# Altium schematic sheet SFP+_Connectors.SchDoc
size A3; SheetNumber: 5; SheetTotal: 22
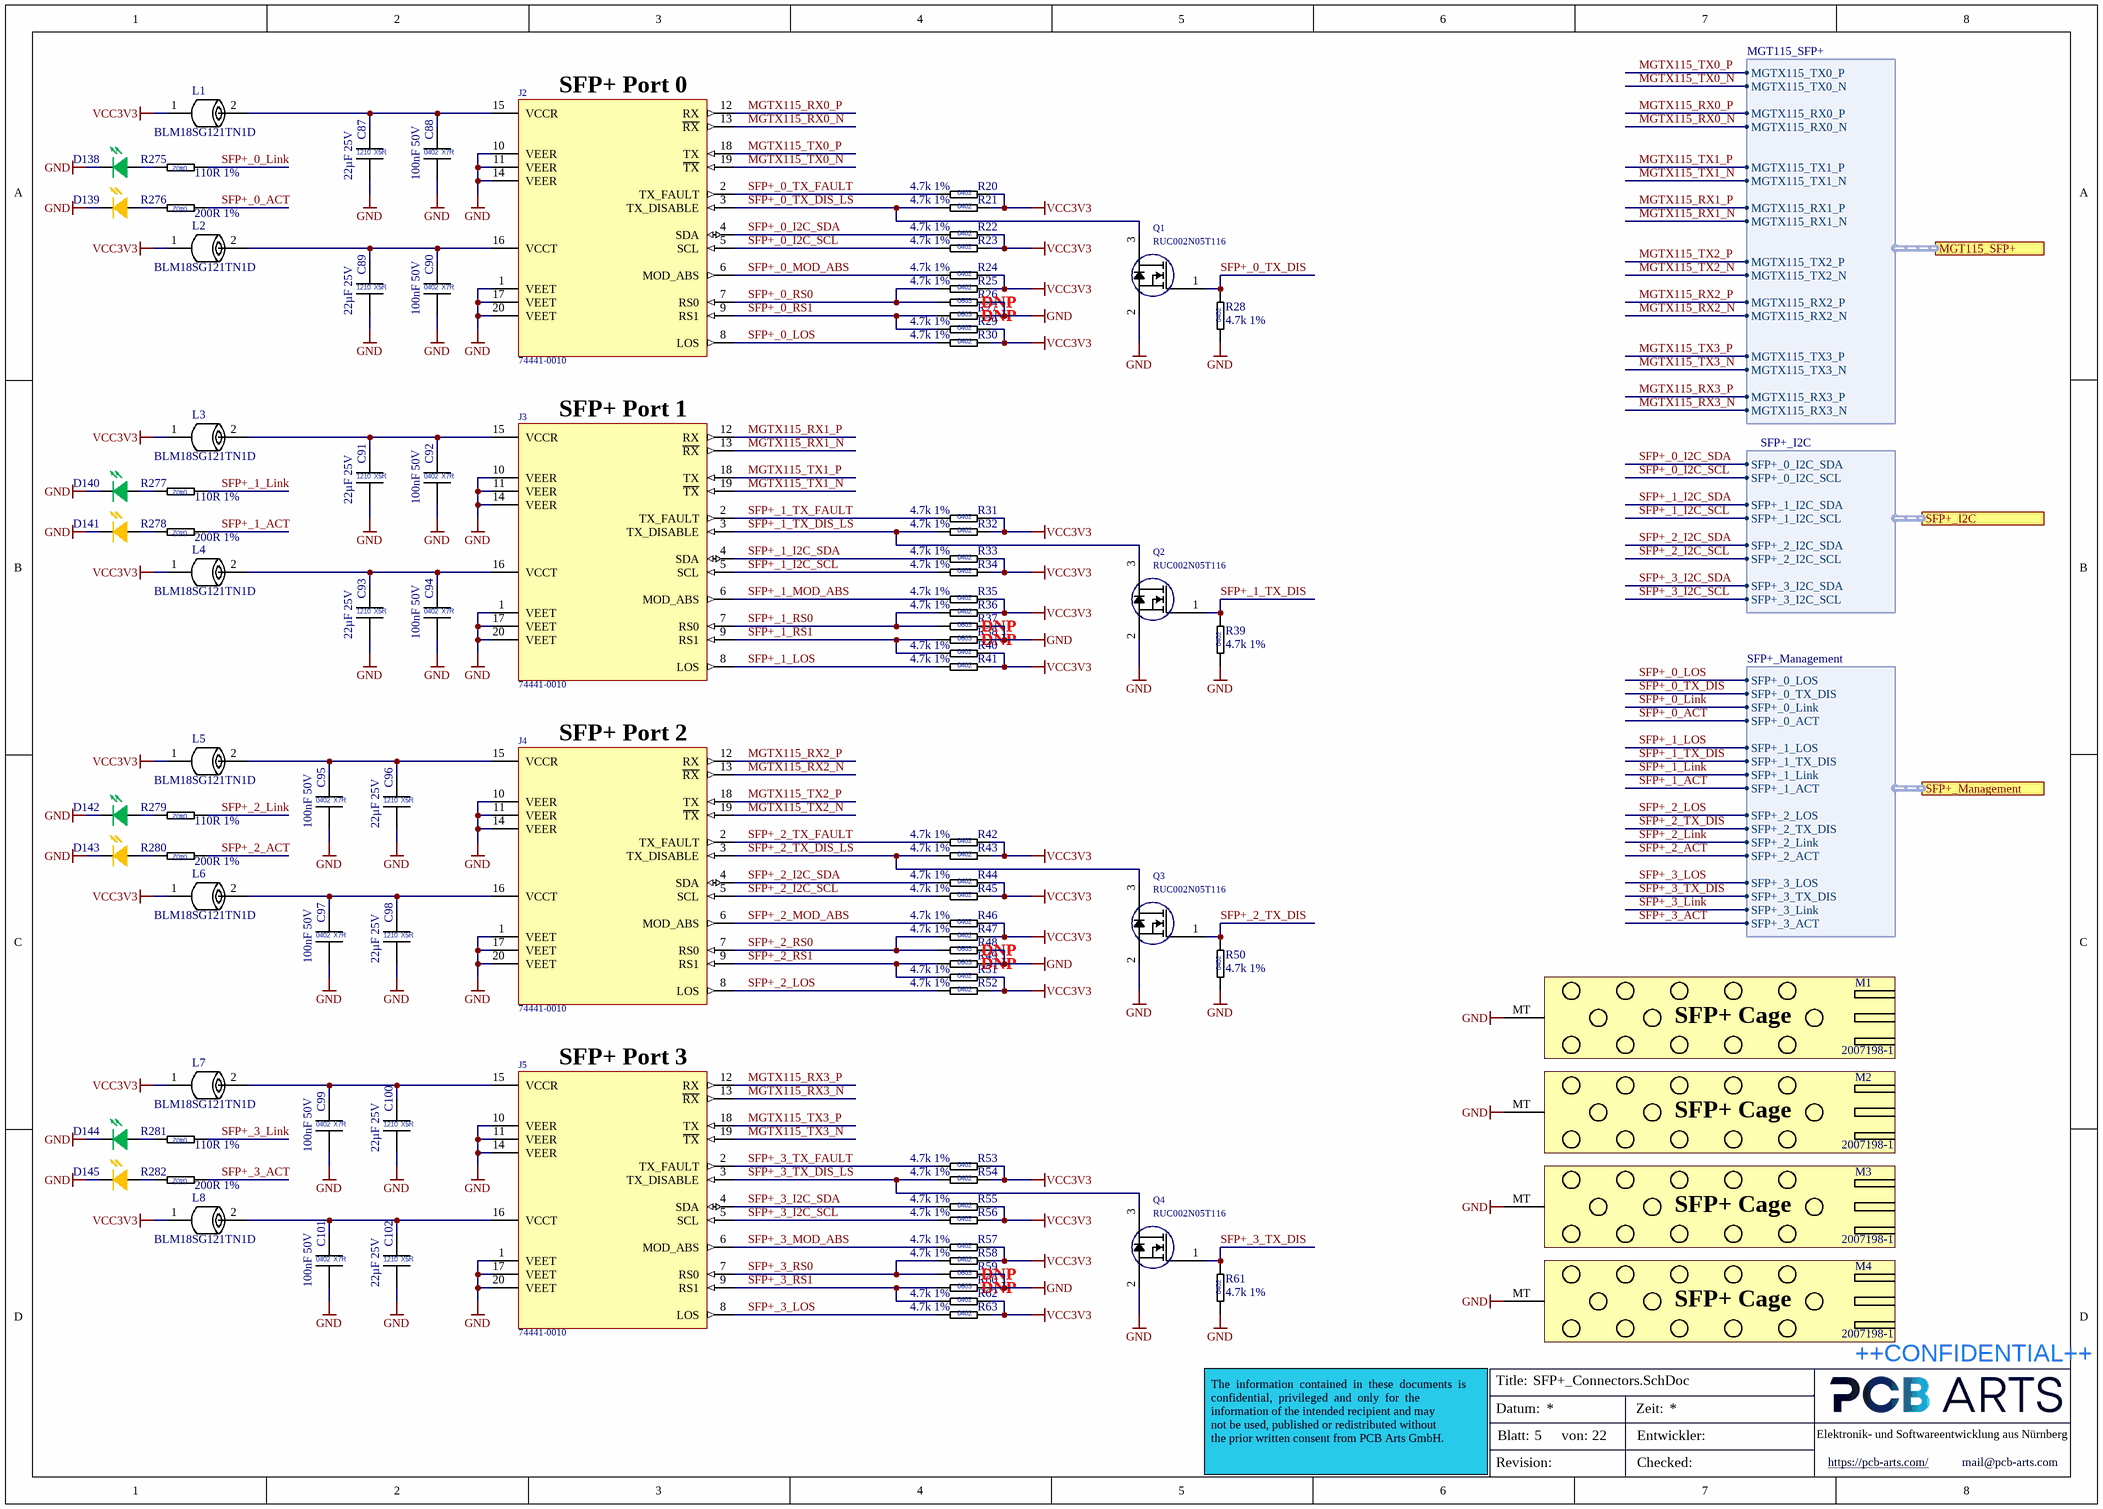
[diagram p0: SFP+_Connectors.SchDoc]

## Parts
C87  22µF 25V  [CAP_1210]
C88  100nF 50V  [CAP_0402_L]
C89  22µF 25V  [CAP_1210]
C90  100nF 50V  [CAP_0402_L]
C91  22µF 25V  [CAP_1210]
C92  100nF 50V  [CAP_0402_L]
C93  22µF 25V  [CAP_1210]
C94  100nF 50V  [CAP_0402_L]
C95  100nF 50V  [CAP_0402_L]
C96  22µF 25V  [CAP_1210]
C97  100nF 50V  [CAP_0402_L]
C98  22µF 25V  [CAP_1210]
C99  100nF 50V  [CAP_0402_L]
C100  22µF 25V  [CAP_1210]
C101  100nF 50V  [CAP_0402_L]
C102  22µF 25V  [CAP_1210]
D138  LTST-S270KGKT  [LED-0603 Sideview]  (value not drawn)
D139  LTST-S270KFKT  [LED-0603 Sideview]  (value not drawn)
D140  LTST-S270KGKT  [LED-0603 Sideview]  (value not drawn)
D141  LTST-S270KFKT  [LED-0603 Sideview]  (value not drawn)
D142  LTST-S270KGKT  [LED-0603 Sideview]  (value not drawn)
D143  LTST-S270KFKT  [LED-0603 Sideview]  (value not drawn)
D144  LTST-S270KGKT  [LED-0603 Sideview]  (value not drawn)
D145  LTST-S270KFKT  [LED-0603 Sideview]  (value not drawn)
J2  74441-0010  [74441-0010]
J3  74441-0010  [74441-0010]
J4  74441-0010  [74441-0010]
J5  74441-0010  [74441-0010]
L1  BLM18SG121TN1D  [L_0603]
L2  BLM18SG121TN1D  [L_0603]
L3  BLM18SG121TN1D  [L_0603]
L4  BLM18SG121TN1D  [L_0603]
L5  BLM18SG121TN1D  [L_0603]
L6  BLM18SG121TN1D  [L_0603]
L7  BLM18SG121TN1D  [L_0603]
L8  BLM18SG121TN1D  [L_0603]
M1  2007198-1  [2007198-1]
M2  2007198-1  [2007198-1]
M3  2007198-1  [2007198-1]
M4  2007198-1  [2007198-1]
Q1  RUC002N05T116  [SOT95P251X112-3N]
Q2  RUC002N05T116  [SOT95P251X112-3N]
Q3  RUC002N05T116  [SOT95P251X112-3N]
Q4  RUC002N05T116  [SOT95P251X112-3N]
R20  4.7k 1%  [RES_0402_L]
R21  4.7k 1%  [RES_0402_L]
R22  4.7k 1%  [RES_0402_L]
R23  4.7k 1%  [RES_0402_L]
R24  4.7k 1%  [RES_0402_L]
R25  4.7k 1%  [RES_0402_L]
R26  0R Jumper  [RES_0603_L]  (value not drawn)  (no BOM)
R27  0R Jumper  [RES_0603_L]  (value not drawn)  (no BOM)
R28  4.7k 1%  [RES_0402_L]
R29  4.7k 1%  [RES_0402_L]
R30  4.7k 1%  [RES_0402_L]
R31  4.7k 1%  [RES_0402_L]
R32  4.7k 1%  [RES_0402_L]
R33  4.7k 1%  [RES_0402_L]
R34  4.7k 1%  [RES_0402_L]
R35  4.7k 1%  [RES_0402_L]
R36  4.7k 1%  [RES_0402_L]
R37  0R Jumper  [RES_0603_L]  (value not drawn)  (no BOM)
R38  0R Jumper  [RES_0603_L]  (value not drawn)  (no BOM)
R39  4.7k 1%  [RES_0402_L]
R40  4.7k 1%  [RES_0402_L]
R41  4.7k 1%  [RES_0402_L]
R42  4.7k 1%  [RES_0402_L]
R43  4.7k 1%  [RES_0402_L]
R44  4.7k 1%  [RES_0402_L]
R45  4.7k 1%  [RES_0402_L]
R46  4.7k 1%  [RES_0402_L]
R47  4.7k 1%  [RES_0402_L]
R48  0R Jumper  [RES_0603_L]  (value not drawn)  (no BOM)
R49  0R Jumper  [RES_0603_L]  (value not drawn)  (no BOM)
R50  4.7k 1%  [RES_0402_L]
R51  4.7k 1%  [RES_0402_L]
R52  4.7k 1%  [RES_0402_L]
R53  4.7k 1%  [RES_0402_L]
R54  4.7k 1%  [RES_0402_L]
R55  4.7k 1%  [RES_0402_L]
R56  4.7k 1%  [RES_0402_L]
R57  4.7k 1%  [RES_0402_L]
R58  4.7k 1%  [RES_0402_L]
R59  0R Jumper  [RES_0603_L]  (value not drawn)  (no BOM)
R60  0R Jumper  [RES_0603_L]  (value not drawn)  (no BOM)
R61  4.7k 1%  [RES_0402_L]
R62  4.7k 1%  [RES_0402_L]
R63  4.7k 1%  [RES_0402_L]
R275  110R 1%  [RES_0402_L]
R276  200R 1%  [RES_0402_L]
R277  110R 1%  [RES_0402_L]
R278  200R 1%  [RES_0402_L]
R279  110R 1%  [RES_0402_L]
R280  200R 1%  [RES_0402_L]
R281  110R 1%  [RES_0402_L]
R282  200R 1%  [RES_0402_L]

## Ports
MGT115_SFP+ (harness MGT115_SFP+, see Top-Level-Sheet[6B], MGT Banks 115-116[8A]), SFP+_I2C (harness SFP+_I2C, see Top-Level-Sheet[6B], I2C Multiplexer[7A]), SFP+_Management (harness SFP+_Management, see Top-Level-Sheet[6B], Bank 13_Bank 15_Bank 16[8D])

## Harnesses
MGT115_SFP+: MGTX115_TX0_P, MGTX115_TX0_N, MGTX115_RX0_P, MGTX115_RX0_N, MGTX115_TX1_P, MGTX115_TX1_N, MGTX115_RX1_P, MGTX115_RX1_N, MGTX115_TX2_P, MGTX115_TX2_N, MGTX115_RX2_P, MGTX115_RX2_N, MGTX115_TX3_P, MGTX115_TX3_N, MGTX115_RX3_P, MGTX115_RX3_N
SFP+_I2C: SFP+_3_I2C_SDA, SFP+_3_I2C_SCL, SFP+_0_I2C_SDA, SFP+_0_I2C_SCL, SFP+_1_I2C_SDA, SFP+_1_I2C_SCL, SFP+_2_I2C_SDA, SFP+_2_I2C_SCL
SFP+_Management: SFP+_0_LOS, SFP+_0_TX_DIS, SFP+_0_Link, SFP+_0_ACT, SFP+_1_LOS, SFP+_1_TX_DIS, SFP+_1_Link, SFP+_1_ACT, SFP+_2_LOS, SFP+_2_TX_DIS, SFP+_2_Link, SFP+_2_ACT, SFP+_3_LOS, SFP+_3_TX_DIS, SFP+_3_Link, SFP+_3_ACT

## Nets
GND: C87.2 C88.2 C89.2 C90.2 C91.2 C92.2 C93.2 C94.2 C95.2 C96.2 C97.2 C98.2 C99.2 C100.2 C101.2 C102.2 D138.1 D139.1 D140.1 D141.1 D142.1 D143.1 D144.1 D145.1 J2.1(VEET) J2.10(VEER) J2.11(VEER) J2.14(VEER) J2.17(VEET) J2.20(VEET) J3.1(VEET) J3.10(VEER) J3.11(VEER) J3.14(VEER) J3.17(VEET) J3.20(VEET) J4.1(VEET) J4.10(VEER) J4.11(VEER) J4.14(VEER) J4.17(VEET) J4.20(VEET) J5.1(VEET) J5.10(VEER) J5.11(VEER) J5.14(VEER) J5.17(VEET) J5.20(VEET) M1.MT M2.MT M3.MT M4.MT Q1.2(D) Q2.2(D) Q3.2(D) Q4.2(D) R26.2 R27.2 R28.1 R37.2 R38.2 R39.1 R48.2 R49.2 R50.1 R59.2 R60.2 R61.1
VCC3V3: L1.1 L2.1 L3.1 L4.1 L5.1 L6.1 L7.1 L8.1 R20.2 R21.2 R22.2 R23.2 R24.2 R25.2 R29.2 R30.2 R31.2 R32.2 R33.2 R34.2 R35.2 R36.2 R40.2 R41.2 R42.2 R43.2 R44.2 R45.2 R46.2 R47.2 R51.2 R52.2 R53.2 R54.2 R55.2 R56.2 R57.2 R58.2 R62.2 R63.2
MGTX115_RX0_N: J2.13(~{RX}) ; port MGT115_SFP+.MGTX115_RX0_N
MGTX115_RX0_P: J2.12(RX) ; port MGT115_SFP+.MGTX115_RX0_P
MGTX115_RX1_N: J3.13(~{RX}) ; port MGT115_SFP+.MGTX115_RX1_N
MGTX115_RX1_P: J3.12(RX) ; port MGT115_SFP+.MGTX115_RX1_P
MGTX115_RX2_N: J4.13(~{RX}) ; port MGT115_SFP+.MGTX115_RX2_N
MGTX115_RX2_P: J4.12(RX) ; port MGT115_SFP+.MGTX115_RX2_P
MGTX115_RX3_N: J5.13(~{RX}) ; port MGT115_SFP+.MGTX115_RX3_N
MGTX115_RX3_P: J5.12(RX) ; port MGT115_SFP+.MGTX115_RX3_P
MGTX115_TX0_N: J2.19(~{TX}) ; port MGT115_SFP+.MGTX115_TX0_N
MGTX115_TX0_P: J2.18(TX) ; port MGT115_SFP+.MGTX115_TX0_P
MGTX115_TX1_N: J3.19(~{TX}) ; port MGT115_SFP+.MGTX115_TX1_N
MGTX115_TX1_P: J3.18(TX) ; port MGT115_SFP+.MGTX115_TX1_P
MGTX115_TX2_N: J4.19(~{TX}) ; port MGT115_SFP+.MGTX115_TX2_N
MGTX115_TX2_P: J4.18(TX) ; port MGT115_SFP+.MGTX115_TX2_P
MGTX115_TX3_N: J5.19(~{TX}) ; port MGT115_SFP+.MGTX115_TX3_N
MGTX115_TX3_P: J5.18(TX) ; port MGT115_SFP+.MGTX115_TX3_P
SFP+_0_ACT: R276.1 ; port SFP+_Management.SFP+_0_ACT
SFP+_0_I2C_SCL: J2.5(SCL) R23.1 ; port SFP+_I2C.SFP+_0_I2C_SCL
SFP+_0_I2C_SDA: J2.4(SDA) R22.1 ; port SFP+_I2C.SFP+_0_I2C_SDA
SFP+_0_Link: R275.1 ; port SFP+_Management.SFP+_0_Link
SFP+_0_LOS: J2.8(LOS) R30.1 ; port SFP+_Management.SFP+_0_LOS
SFP+_0_MOD_ABS: J2.6(MOD_ABS) R24.1
SFP+_0_RS0: J2.7(RS0) R25.1 R26.1
SFP+_0_RS1: J2.9(RS1) R27.1 R29.1
SFP+_0_TX_DIS: Q1.1(G) R28.2 ; port SFP+_Management.SFP+_0_TX_DIS
SFP+_0_TX_DIS_LS: J2.3(TX_DISABLE) Q1.3(S) R21.1
SFP+_0_TX_FAULT: J2.2(TX_FAULT) R20.1
SFP+_1_ACT: R278.1 ; port SFP+_Management.SFP+_1_ACT
SFP+_1_I2C_SCL: J3.5(SCL) R34.1 ; port SFP+_I2C.SFP+_1_I2C_SCL
SFP+_1_I2C_SDA: J3.4(SDA) R33.1 ; port SFP+_I2C.SFP+_1_I2C_SDA
SFP+_1_Link: R277.1 ; port SFP+_Management.SFP+_1_Link
SFP+_1_LOS: J3.8(LOS) R41.1 ; port SFP+_Management.SFP+_1_LOS
SFP+_1_MOD_ABS: J3.6(MOD_ABS) R35.1
SFP+_1_RS0: J3.7(RS0) R36.1 R37.1
SFP+_1_RS1: J3.9(RS1) R38.1 R40.1
SFP+_1_TX_DIS: Q2.1(G) R39.2 ; port SFP+_Management.SFP+_1_TX_DIS
SFP+_1_TX_DIS_LS: J3.3(TX_DISABLE) Q2.3(S) R32.1
SFP+_1_TX_FAULT: J3.2(TX_FAULT) R31.1
SFP+_2_ACT: R280.1 ; port SFP+_Management.SFP+_2_ACT
SFP+_2_I2C_SCL: J4.5(SCL) R45.1 ; port SFP+_I2C.SFP+_2_I2C_SCL
SFP+_2_I2C_SDA: J4.4(SDA) R44.1 ; port SFP+_I2C.SFP+_2_I2C_SDA
SFP+_2_Link: R279.1 ; port SFP+_Management.SFP+_2_Link
SFP+_2_LOS: J4.8(LOS) R52.1 ; port SFP+_Management.SFP+_2_LOS
SFP+_2_MOD_ABS: J4.6(MOD_ABS) R46.1
SFP+_2_RS0: J4.7(RS0) R47.1 R48.1
SFP+_2_RS1: J4.9(RS1) R49.1 R51.1
SFP+_2_TX_DIS: Q3.1(G) R50.2 ; port SFP+_Management.SFP+_2_TX_DIS
SFP+_2_TX_DIS_LS: J4.3(TX_DISABLE) Q3.3(S) R43.1
SFP+_2_TX_FAULT: J4.2(TX_FAULT) R42.1
SFP+_3_ACT: R282.1 ; port SFP+_Management.SFP+_3_ACT
SFP+_3_I2C_SCL: J5.5(SCL) R56.1 ; port SFP+_I2C.SFP+_3_I2C_SCL
SFP+_3_I2C_SDA: J5.4(SDA) R55.1 ; port SFP+_I2C.SFP+_3_I2C_SDA
SFP+_3_Link: R281.1 ; port SFP+_Management.SFP+_3_Link
SFP+_3_LOS: J5.8(LOS) R63.1 ; port SFP+_Management.SFP+_3_LOS
SFP+_3_MOD_ABS: J5.6(MOD_ABS) R57.1
SFP+_3_RS0: J5.7(RS0) R58.1 R59.1
SFP+_3_RS1: J5.9(RS1) R60.1 R62.1
SFP+_3_TX_DIS: Q4.1(G) R61.2 ; port SFP+_Management.SFP+_3_TX_DIS
SFP+_3_TX_DIS_LS: J5.3(TX_DISABLE) Q4.3(S) R54.1
SFP+_3_TX_FAULT: J5.2(TX_FAULT) R53.1
NetC87_1: C87.1 C88.1 J2.15(VCCR) L1.2
NetC89_1: C89.1 C90.1 J2.16(VCCT) L2.2
NetC91_1: C91.1 C92.1 J3.15(VCCR) L3.2
NetC93_1: C93.1 C94.1 J3.16(VCCT) L4.2
NetC95_1: C95.1 C96.1 J4.15(VCCR) L5.2
NetC97_1: C97.1 C98.1 J4.16(VCCT) L6.2
NetC99_1: C99.1 C100.1 J5.15(VCCR) L7.2
NetC101_1: C101.1 C102.1 J5.16(VCCT) L8.2
NetD138_2: D138.2 R275.2
NetD139_2: D139.2 R276.2
NetD140_2: D140.2 R277.2
NetD141_2: D141.2 R278.2
NetD142_2: D142.2 R279.2
NetD143_2: D143.2 R280.2
NetD144_2: D144.2 R281.2
NetD145_2: D145.2 R282.2

## Notes on the sheet
- (near J2) SFP+ Port 0
- DNP
- (near J3) SFP+ Port 1
- (near J4) SFP+ Port 2
- (near J5) SFP+ Port 3
- Title:
- ++CONFIDENTIAL++
- Datum:
- Blatt:
- von:
- Zeit:
- Entwickler:
- Elektronik- und Softwareentwicklung aus Nürnberg
- The  information  contained  in  these  documents  is  confidential,  privileged  and  only  for  the
  information of the intended recipient and may
  not be used, published or redistributed without
  the prior written consent from PCB Arts GmbH.
- Revision:
- Checked:
- https://pcb-arts.com/
- mail@pcb-arts.com
- (in symbol 2007198-1_2SFP+ Cage, 1x1, external EMV springs, no lightpipes) SFP+ Cage
- (in symbol CAP_0402_100nF_50V) 0402; X7R
- (in symbol CAP_1210_22µF_25V) 1210; X5R
- (in symbol RES_0402_4.7k_1%) 0402
- (in symbol RES_0402_110R_1%) 0402
- (in symbol RES_0402_200R 1%) 0402
- (in symbol RES_0603_0R_Jumper) 0603

## Library data of the parts
C87 C89 C91 C93 C96 C98 C100 C102 = CAP_1210_22µF_25V: Multilayer Ceramic Capacitors MLCC - SMD/SMT 1210 25VDC; Manufacturer 1: KEMET; Manufacturer 1 Prt. Nr.: C1210C226K3PACTU; Manufacturer 2 Prt. Nr.: TMK212BBJ226MG-TT; Manufacturer 2: Taiyo Yuden
C88 C90 C92 C94 C95 C97 C99 C101 = CAP_0402_100nF_50V: Multilayer Ceramic Capacitors MLCC - SMD/SMT 0402 50VDC; Manufacturer 1: Murata Electronics; Manufacturer 1 Prt. Nr.: GCM155L8EH104KE07D; Manufacturer 2 Prt. Nr.: UMK105B7104KV-FR; Manufacturer 2: TDK
D138 D140 D142 D144 = LED 0603 Green Sideview: GREEN  0603 Light Emitting Diode; Manufacturer 1: lite-On; Manufacturer 1 Prt. Nr.: LTST-S270KGKT; Color: Green
D139 D141 D143 D145 = LED 0603 ORANGE Sideview: ORANGE 0603 Light Emitting Diode; Manufacturer 1: lite-On; Manufacturer 1 Prt. Nr.: LTST-S270KFKT; Color: Orange
J2-J5 = 74441-0010_Card Edge Connector for SFP+: 20 Pin Right Angle 0.8mm SMD Card Edge Connector for SFP+; Manufacturer 1: Molex; Manufacturer 1 Prt. Nr.: 74441-0010
L1-L8 = BLM18SG121TN1D_Ferrite Beads 0603 120Ohms 3000mA: Ferritperlen BLM18_xN 0603 100MHz 120Ohm 3000mA 25mOhm RSER; Manufacturer 1: Murata Electronics; Manufacturer 1 Prt. Nr.: BLM18SG121TN1D
M1-M4 = 2007198-1_2SFP+ Cage, 1x1, external EMV springs, no lightpipes: 2SFP+ Cage, 1x1, external EMV springs, no lightpipes; Manufacturer 1: TE Connectivity; Manufacturer 1 Prt. Nr.: 2007198-1
Q1-Q4 = RUC002N05T116_MOSFET N-Ch 1.2 VGS Spec: MOSFET N-Ch 1.2 VGS Spec; Manufacturer 1: ROHM Semiconductor; Manufacturer 1 Prt. Nr.: RUC002N05T116
R20-R25 R28-R36 R39-R47 R50-R58 R61-R63 = RES_0402_4.7k_1%: Thick Film Resistors - SMD 4.7kOhm 1%; Manufacturer 1: Vishay / Dale; Manufacturer 1 Prt. Nr.: CRCW04024K70FKEDC; Manufacturer 2 Prt. Nr.: RC0402FR-134K7L; Manufacturer 2: Yageo
R26 R27 R37 R38 R48 R49 R59 R60 = RES_0603_0R_Jumper: Thick Film Resistors - SMD 0Ohm Jumper; Manufacturer 1: Yageo; Manufacturer 1 Prt. Nr.: RC0603JR-100RL; Manufacturer 2 Prt. Nr.: CRCW06030000Z0EBC; Manufacturer 2: Vishay / Draloric
R275 R277 R279 R281 = RES_0402_110R_1%: Thick Film Resistors - SMD 110Ohm 1%; Manufacturer 1: Vishay / Dale; Manufacturer 1 Prt. Nr.: CRCW0402110RFKTD; Manufacturer 2 Prt. Nr.: RC0402FR-7W110RL; Manufacturer 2: Yageo
R276 R278 R280 R282 = RES_0402_200R 1%: Thick Film Resistors - SMD 200Ohm 1%; Manufacturer 1: Vishay / Dale; Manufacturer 1 Prt. Nr.: CRCW0402200RFKEDC; Manufacturer 2 Prt. Nr.: AF0402FR-07200RL; Manufacturer 2: Yageo